# Altium schematic sheet Modulo Servo.SchDoc
size A4
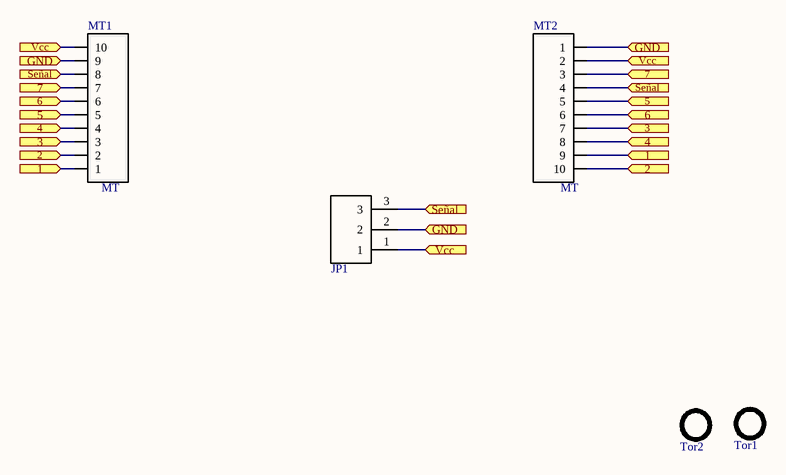
[diagram p0: Modulo Servo.SchDoc]

## Parts
JP1  Pines (3X2.54)  [Pin(3X2.54mm)]  (value not drawn)
MT1  MT  [Micro-MaTch Famale 1.27mm/SMD]
MT2  MT  [Micro-MaTch Famale 1.27mm/SMD]
Tor1  Tornillo3MM  [Taladro_3mm]  (value not drawn)
Tor2  Tornillo3MM  [Taladro_3mm]  (value not drawn)

## Ports
1 (in), 2 (in), 3 (in), 4 (in), 5 (in), 6 (in), 7 (in), GND (in), Señal (in), Vcc (in)

## Nets
1: MT1.1 MT2.9 ; port 1
2: MT1.2 MT2.10 ; port 2
3: MT1.3 MT2.7 ; port 3
4: MT1.4 MT2.8 ; port 4
5: MT1.5 MT2.5 ; port 5
6: MT1.6 MT2.6 ; port 6
7: MT1.7 MT2.3 ; port 7
GND: JP1.2 MT1.9 MT2.1 ; port GND
Señal: JP1.3 MT1.8 MT2.4 ; port Señal
Vcc: JP1.1 MT1.10 MT2.2 ; port Vcc

## Library data of the parts
MT1 MT2 = Micro-MaTch Famale 1.27mm: Micro-MaTch Famale 1.27mm T/Hole
Tor1 Tor2 = Taladro_3mm